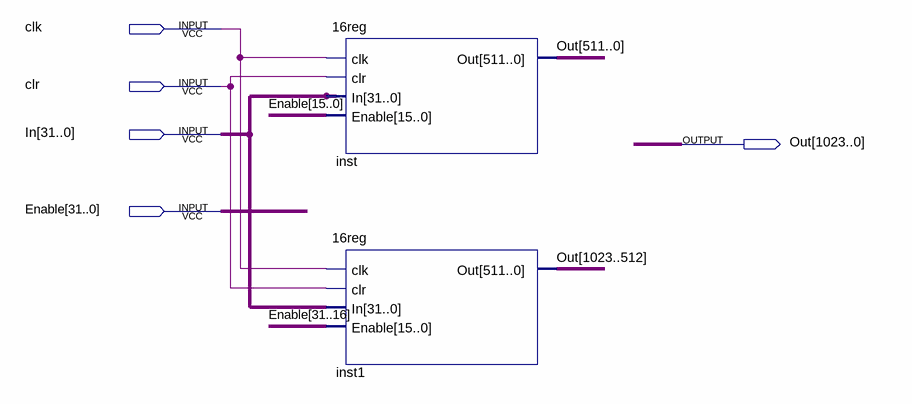
[diagram p0: schematic sheet]
// Quartus schematic 32reg.bdf as structural Verilog: 2 symbols, 5 pins
module \32reg  (
  input  clk,
  input  clr,
  input  [31:0] In,
  input  [31:0] Enable,
  output [1023:0] Out
);

  \16reg  inst (.clk(clk), .clr(clr), .In(In), .Enable(Enable[15:0]), .Out(Out[511:0]));
  \16reg  inst1 (.clk(clk), .clr(clr), .In(In), .Enable(Enable[31:16]), .Out(Out[1023:512]));
endmodule
